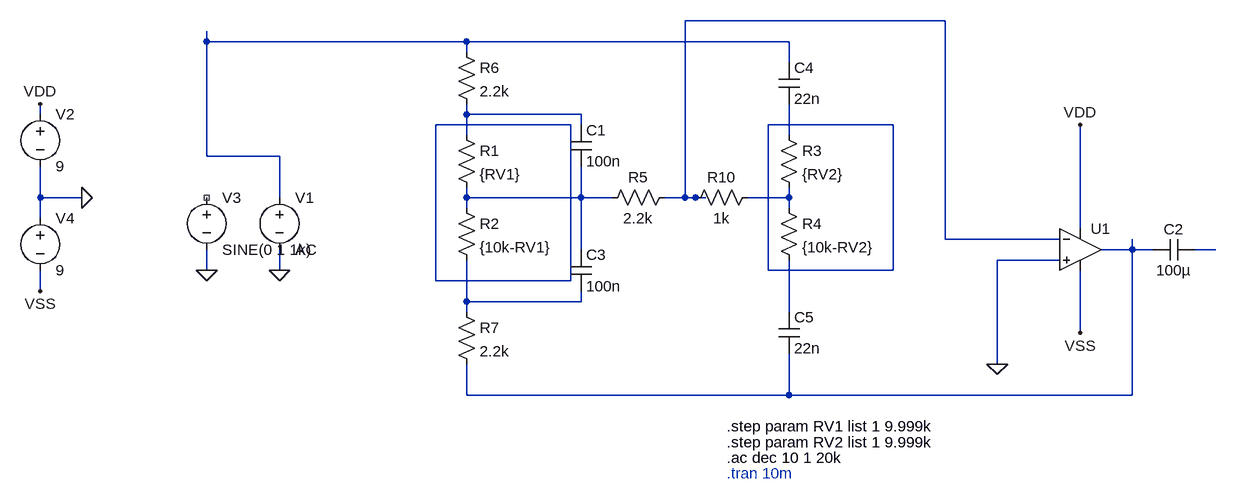
[diagram p0: schematic simple_circuitv2.asc]
simple_circuitv2.asc, the LTspice schematic file:
Version 4
SHEET 1 1316 964
WIRE 672 -48 272 -48
WIRE -464 -16 -464 -32
WIRE -64 -16 -464 -16
WIRE 432 -16 -64 -16
WIRE -64 0 -64 -16
WIRE 432 16 432 -16
WIRE -720 96 -720 80
WIRE -64 96 -64 80
WIRE 112 96 -64 96
WIRE 96 112 -112 112
WIRE 112 112 112 96
WIRE 592 112 400 112
WIRE -64 128 -64 96
WIRE 432 128 432 80
WIRE -464 160 -464 -16
WIRE -352 160 -464 160
WIRE -720 224 -720 176
WIRE -656 224 -720 224
WIRE -352 224 -352 160
WIRE -64 224 -64 208
WIRE 112 224 112 176
WIRE 112 224 -64 224
WIRE 160 224 112 224
WIRE 272 224 272 -48
WIRE 272 224 240 224
WIRE 288 224 272 224
WIRE 304 224 288 224
WIRE 432 224 432 208
WIRE 432 224 368 224
WIRE -64 240 -64 224
WIRE 432 240 432 224
WIRE -720 256 -720 224
WIRE 880 272 880 112
WIRE 672 288 672 -48
WIRE 848 288 672 288
WIRE 112 304 112 224
WIRE 960 304 960 288
WIRE 960 304 912 304
WIRE 992 304 960 304
WIRE 1088 304 1056 304
WIRE 848 320 752 320
WIRE -464 336 -464 304
WIRE -352 336 -352 304
WIRE 400 336 400 112
WIRE 592 336 592 112
WIRE 592 336 400 336
WIRE -112 352 -112 112
WIRE 96 352 96 112
WIRE 96 352 -112 352
WIRE -720 368 -720 336
WIRE -64 384 -64 320
WIRE 112 384 112 368
WIRE 112 384 -64 384
WIRE -64 400 -64 384
WIRE 432 400 432 320
WIRE 880 432 880 336
WIRE 752 480 752 320
WIRE -64 528 -64 480
WIRE 432 528 432 464
WIRE 432 528 -64 528
WIRE 960 528 960 304
WIRE 960 528 432 528
FLAG -352 336 0
FLAG -720 80 VDD
FLAG -656 224 0
FLAG 880 112 VDD
FLAG -464 336 0
FLAG 752 480 0
FLAG 880 432 VSS
FLAG -720 368 VSS
SYMBOL res -80 112 R0
SYMATTR InstName R1
SYMATTR Value {RV1}
SYMBOL res -80 224 R0
SYMATTR InstName R2
SYMATTR Value {10k-RV1}
SYMBOL res 416 112 R0
SYMATTR InstName R3
SYMATTR Value {RV2}
SYMBOL res 416 224 R0
SYMATTR InstName R4
SYMATTR Value {10k-RV2}
SYMBOL voltage -352 208 R0
SYMATTR InstName V1
SYMATTR Value AC
SYMBOL voltage -720 80 R0
WINDOW 123 0 0 Left 0
WINDOW 39 0 0 Left 0
SYMATTR InstName V2
SYMATTR Value 9
SYMBOL OpAmps\\UniversalOpAmp2 880 304 R0
SYMATTR InstName U1
SYMBOL voltage -464 208 R0
WINDOW 123 0 0 Left 0
WINDOW 39 0 0 Left 0
SYMATTR InstName V3
SYMATTR Value SINE(0 1 1k)
SYMBOL res 256 208 R90
WINDOW 0 0 56 VBottom 2
WINDOW 3 32 56 VTop 2
SYMATTR InstName R5
SYMATTR Value 2.2k
SYMBOL res -80 -16 R0
SYMATTR InstName R6
SYMATTR Value 2.2k
SYMBOL res -80 384 R0
SYMATTR InstName R7
SYMATTR Value 2.2k
SYMBOL cap 1056 288 R90
WINDOW 0 0 32 VBottom 2
WINDOW 3 32 32 VTop 2
SYMATTR InstName C2
SYMATTR Value 100µ
SYMBOL res 384 208 R90
WINDOW 0 0 56 VBottom 2
WINDOW 3 32 56 VTop 2
SYMATTR InstName R10
SYMATTR Value 1k
SYMBOL cap 96 112 R0
SYMATTR InstName C1
SYMATTR Value 100n
SYMBOL cap 96 304 R0
SYMATTR InstName C3
SYMATTR Value 100n
SYMBOL cap 416 16 R0
SYMATTR InstName C4
SYMATTR Value 22n
SYMBOL cap 416 400 R0
SYMATTR InstName C5
SYMATTR Value 22n
SYMBOL voltage -720 240 R0
WINDOW 123 0 0 Left 0
WINDOW 39 0 0 Left 0
SYMATTR InstName V4
SYMATTR Value 9
TEXT 336 600 Left 2 !.step param RV2 list 1 9.999k
TEXT 336 624 Left 2 !.ac dec 10 1 20k
TEXT 336 576 Left 2 !.step param RV1 list 1 9.999k
TEXT 336 648 Left 2 ;.tran 10m

The netlist it stands for:
* simple_circuitv2.asc
R1 N003 N007 {RV1}
R2 N007 N011 {10k-RV1}
R3 N006 N008 {RV2}
R4 N008 N012 {10k-RV2}
V1 N002 0 AC
V2 VDD 0 9
XU1 0 N001 VDD VSS N009 level2 Avol=1Meg GBW=10Meg Slew=10Meg Ilimit=25m Rail=0 Vos=0 En=0 Enk=0 In=0 Ink=0 Rin=500Meg  ; pins In+ In- V+ V- OUT
V3 NC_01 0 SINE(0 1 1k)
R5 N001 N007 2.2k
R6 N002 N003 2.2k
R7 N011 N009 2.2k
C2 N010 N009 100µ
R10 N008 N001 1k
C1 N003 N007 100n
C3 N007 N011 100n
C4 N002 N006 22n
C5 N012 N009 22n
V4 0 VSS 9
.step param RV2 list 1 9.999k
.ac dec 10 1 20k
.step param RV1 list 1 9.999k
* .tran 10m
.lib UniversalOpAmp2.lib
.backanno
.end